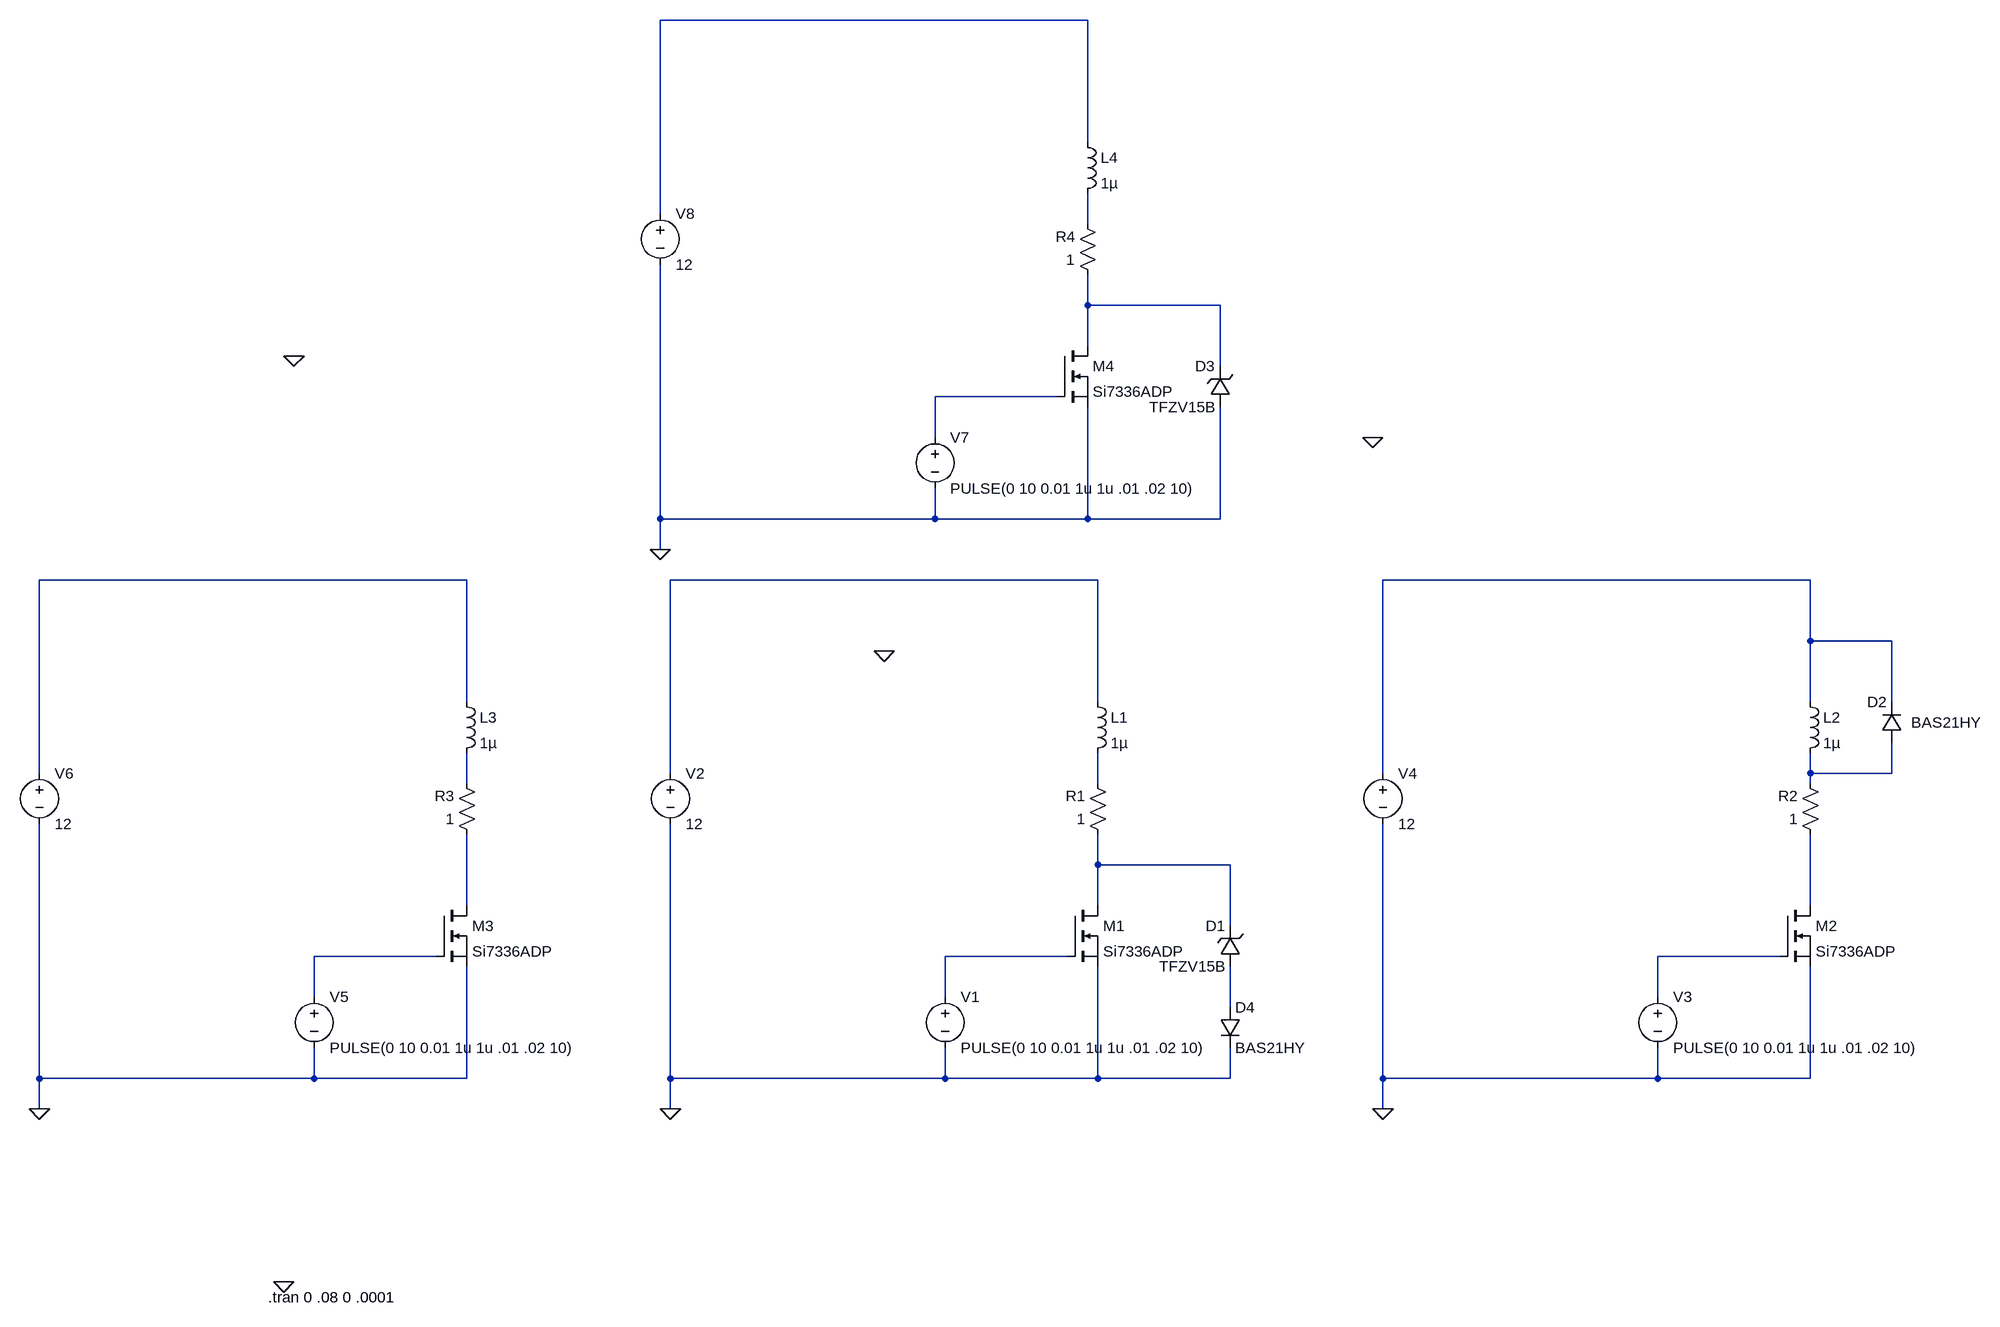
[diagram p0: schematic Relay Coil Driver.asc]
Relay Coil Driver.asc, the LTspice schematic file:
Version 4
SHEET 1 1724 1032
WIRE 320 -992 -352 -992
WIRE 320 -800 320 -992
WIRE -352 -688 -352 -992
WIRE 320 -672 320 -720
WIRE 320 -544 320 -592
WIRE 528 -544 320 -544
WIRE 320 -480 320 -544
WIRE 528 -448 528 -544
WIRE 272 -400 80 -400
WIRE 80 -336 80 -400
WIRE -352 -208 -352 -608
WIRE 80 -208 80 -256
WIRE 80 -208 -352 -208
WIRE 320 -208 320 -384
WIRE 320 -208 80 -208
WIRE 528 -208 528 -384
WIRE 528 -208 320 -208
WIRE -352 -160 -352 -208
WIRE -656 -112 -1328 -112
WIRE 336 -112 -336 -112
WIRE 1456 -112 784 -112
WIRE 1456 -16 1456 -112
WIRE 1584 -16 1456 -16
WIRE -656 80 -656 -112
WIRE 336 80 336 -112
WIRE 1456 80 1456 -16
WIRE 1584 80 1584 -16
WIRE -1328 192 -1328 -112
WIRE -336 192 -336 -112
WIRE 784 192 784 -112
WIRE 1456 192 1456 160
WIRE 1584 192 1584 144
WIRE 1584 192 1456 192
WIRE -656 208 -656 160
WIRE 336 208 336 160
WIRE 1456 208 1456 192
WIRE 336 336 336 288
WIRE 544 336 336 336
WIRE -656 400 -656 288
WIRE 336 400 336 336
WIRE 1456 400 1456 288
WIRE 544 432 544 336
WIRE -704 480 -896 480
WIRE 288 480 96 480
WIRE 1408 480 1216 480
WIRE -896 544 -896 480
WIRE 96 544 96 480
WIRE 1216 544 1216 480
WIRE 544 560 544 496
WIRE -1328 672 -1328 272
WIRE -896 672 -896 624
WIRE -896 672 -1328 672
WIRE -656 672 -656 496
WIRE -656 672 -896 672
WIRE -336 672 -336 272
WIRE 96 672 96 624
WIRE 96 672 -336 672
WIRE 336 672 336 496
WIRE 336 672 96 672
WIRE 544 672 544 624
WIRE 544 672 336 672
WIRE 784 672 784 272
WIRE 1216 672 1216 624
WIRE 1216 672 784 672
WIRE 1456 672 1456 496
WIRE 1456 672 1216 672
WIRE -1328 720 -1328 672
WIRE -336 720 -336 672
WIRE 784 720 784 672
FLAG 768 -336 0
FLAG -944 992 0
FLAG -336 720 0
FLAG 784 720 0
FLAG -1328 720 0
FLAG -352 -160 0
FLAG -928 -464 0
FLAG 0 0 0
SYMBOL ind 320 64 R0
SYMATTR InstName L1
SYMATTR Value 1µ
SYMATTR SpiceLine Rser=6
SYMBOL res 352 304 R180
WINDOW 0 36 76 Left 2
WINDOW 3 36 40 Left 2
SYMATTR InstName R1
SYMATTR Value 1
SYMBOL nmos 288 400 R0
SYMATTR InstName M1
SYMATTR Value Si7336ADP
SYMBOL voltage 96 528 R0
WINDOW 123 0 0 Left 0
WINDOW 39 0 0 Left 0
SYMATTR InstName V1
SYMATTR Value PULSE(0 10 0.01 1u 1u .01 .02 10)
SYMBOL voltage -336 176 R0
WINDOW 123 0 0 Left 0
WINDOW 39 0 0 Left 0
SYMATTR InstName V2
SYMATTR Value 12
SYMBOL ind 1440 64 R0
SYMATTR InstName L2
SYMATTR Value 1µ
SYMATTR SpiceLine Rser=6
SYMBOL res 1472 304 R180
WINDOW 0 36 76 Left 2
WINDOW 3 36 40 Left 2
SYMATTR InstName R2
SYMATTR Value 1
SYMBOL nmos 1408 400 R0
SYMATTR InstName M2
SYMATTR Value Si7336ADP
SYMBOL voltage 1216 528 R0
WINDOW 123 0 0 Left 0
WINDOW 39 0 0 Left 0
SYMATTR InstName V3
SYMATTR Value PULSE(0 10 0.01 1u 1u .01 .02 10)
SYMBOL voltage 784 176 R0
WINDOW 123 0 0 Left 0
WINDOW 39 0 0 Left 0
SYMATTR InstName V4
SYMATTR Value 12
SYMBOL ind -672 64 R0
SYMATTR InstName L3
SYMATTR Value 1µ
SYMATTR SpiceLine Rser=6
SYMBOL res -640 304 R180
WINDOW 0 36 76 Left 2
WINDOW 3 36 40 Left 2
SYMATTR InstName R3
SYMATTR Value 1
SYMBOL nmos -704 400 R0
SYMATTR InstName M3
SYMATTR Value Si7336ADP
SYMBOL voltage -896 528 R0
WINDOW 123 0 0 Left 0
WINDOW 39 0 0 Left 0
SYMATTR InstName V5
SYMATTR Value PULSE(0 10 0.01 1u 1u .01 .02 10)
SYMBOL voltage -1328 176 R0
WINDOW 123 0 0 Left 0
WINDOW 39 0 0 Left 0
SYMATTR InstName V6
SYMATTR Value 12
SYMBOL zener 560 496 R180
WINDOW 0 24 64 Left 2
WINDOW 3 24 0 Left 2
SYMATTR InstName D1
SYMATTR Value TFZV15B
SYMATTR Description Diode
SYMATTR Type diode
SYMBOL diode 1600 144 R180
WINDOW 0 24 64 Left 2
WINDOW 3 -122 32 Left 2
SYMATTR InstName D2
SYMATTR Value BAS21HY
SYMBOL ind 304 -816 R0
SYMATTR InstName L4
SYMATTR Value 1µ
SYMATTR SpiceLine Rser=6
SYMBOL res 336 -576 R180
WINDOW 0 36 76 Left 2
WINDOW 3 36 40 Left 2
SYMATTR InstName R4
SYMATTR Value 1
SYMBOL nmos 272 -480 R0
SYMATTR InstName M4
SYMATTR Value Si7336ADP
SYMBOL voltage 80 -352 R0
WINDOW 123 0 0 Left 0
WINDOW 39 0 0 Left 0
SYMATTR InstName V7
SYMATTR Value PULSE(0 10 0.01 1u 1u .01 .02 10)
SYMBOL voltage -352 -704 R0
WINDOW 123 0 0 Left 0
WINDOW 39 0 0 Left 0
SYMATTR InstName V8
SYMATTR Value 12
SYMBOL zener 544 -384 R180
WINDOW 0 24 64 Left 2
WINDOW 3 24 0 Left 2
SYMATTR InstName D3
SYMATTR Value TFZV15B
SYMATTR Description Diode
SYMATTR Type diode
SYMBOL diode 528 560 R0
SYMATTR InstName D4
SYMATTR Value BAS21HY
TEXT -968 1016 Left 2 !.tran 0 .08 0 .0001

The netlist it stands for:
* Relay Coil Driver.asc
L1 N006 N010 1µ Rser=6
R1 N011 N010 1
M1 N011 N015 0 0 Si7336ADP
V1 N015 0 PULSE(0 10 0.01 1u 1u .01 .02 10)
V2 N006 0 12
L2 N007 N008 1µ Rser=6
R2 N013 N008 1
M2 N013 N016 0 0 Si7336ADP
V3 N016 0 PULSE(0 10 0.01 1u 1u .01 .02 10)
V4 N007 0 12
L3 N005 N009 1µ Rser=6
R3 N012 N009 1
M3 N012 N014 0 0 Si7336ADP
V5 N014 0 PULSE(0 10 0.01 1u 1u .01 .02 10)
V6 N005 0 12
D1 N017 N011 TFZV15B
D2 N008 N007 BAS21HY
L4 N001 N002 1µ Rser=6
R4 N003 N002 1
M4 N003 N004 0 0 Si7336ADP
V7 N004 0 PULSE(0 10 0.01 1u 1u .01 .02 10)
V8 N001 0 12
D3 0 N003 TFZV15B
D4 N017 0 BAS21HY
.model D D
.lib standard.dio
.model NMOS NMOS
.model PMOS PMOS
.lib standard.mos
.tran 0 .08 0 .0001
.backanno
.end